# Altium schematic sheet MCUCustom.SchDoc
size OrCAD C; SheetNumber: 2; SheetTotal: 6
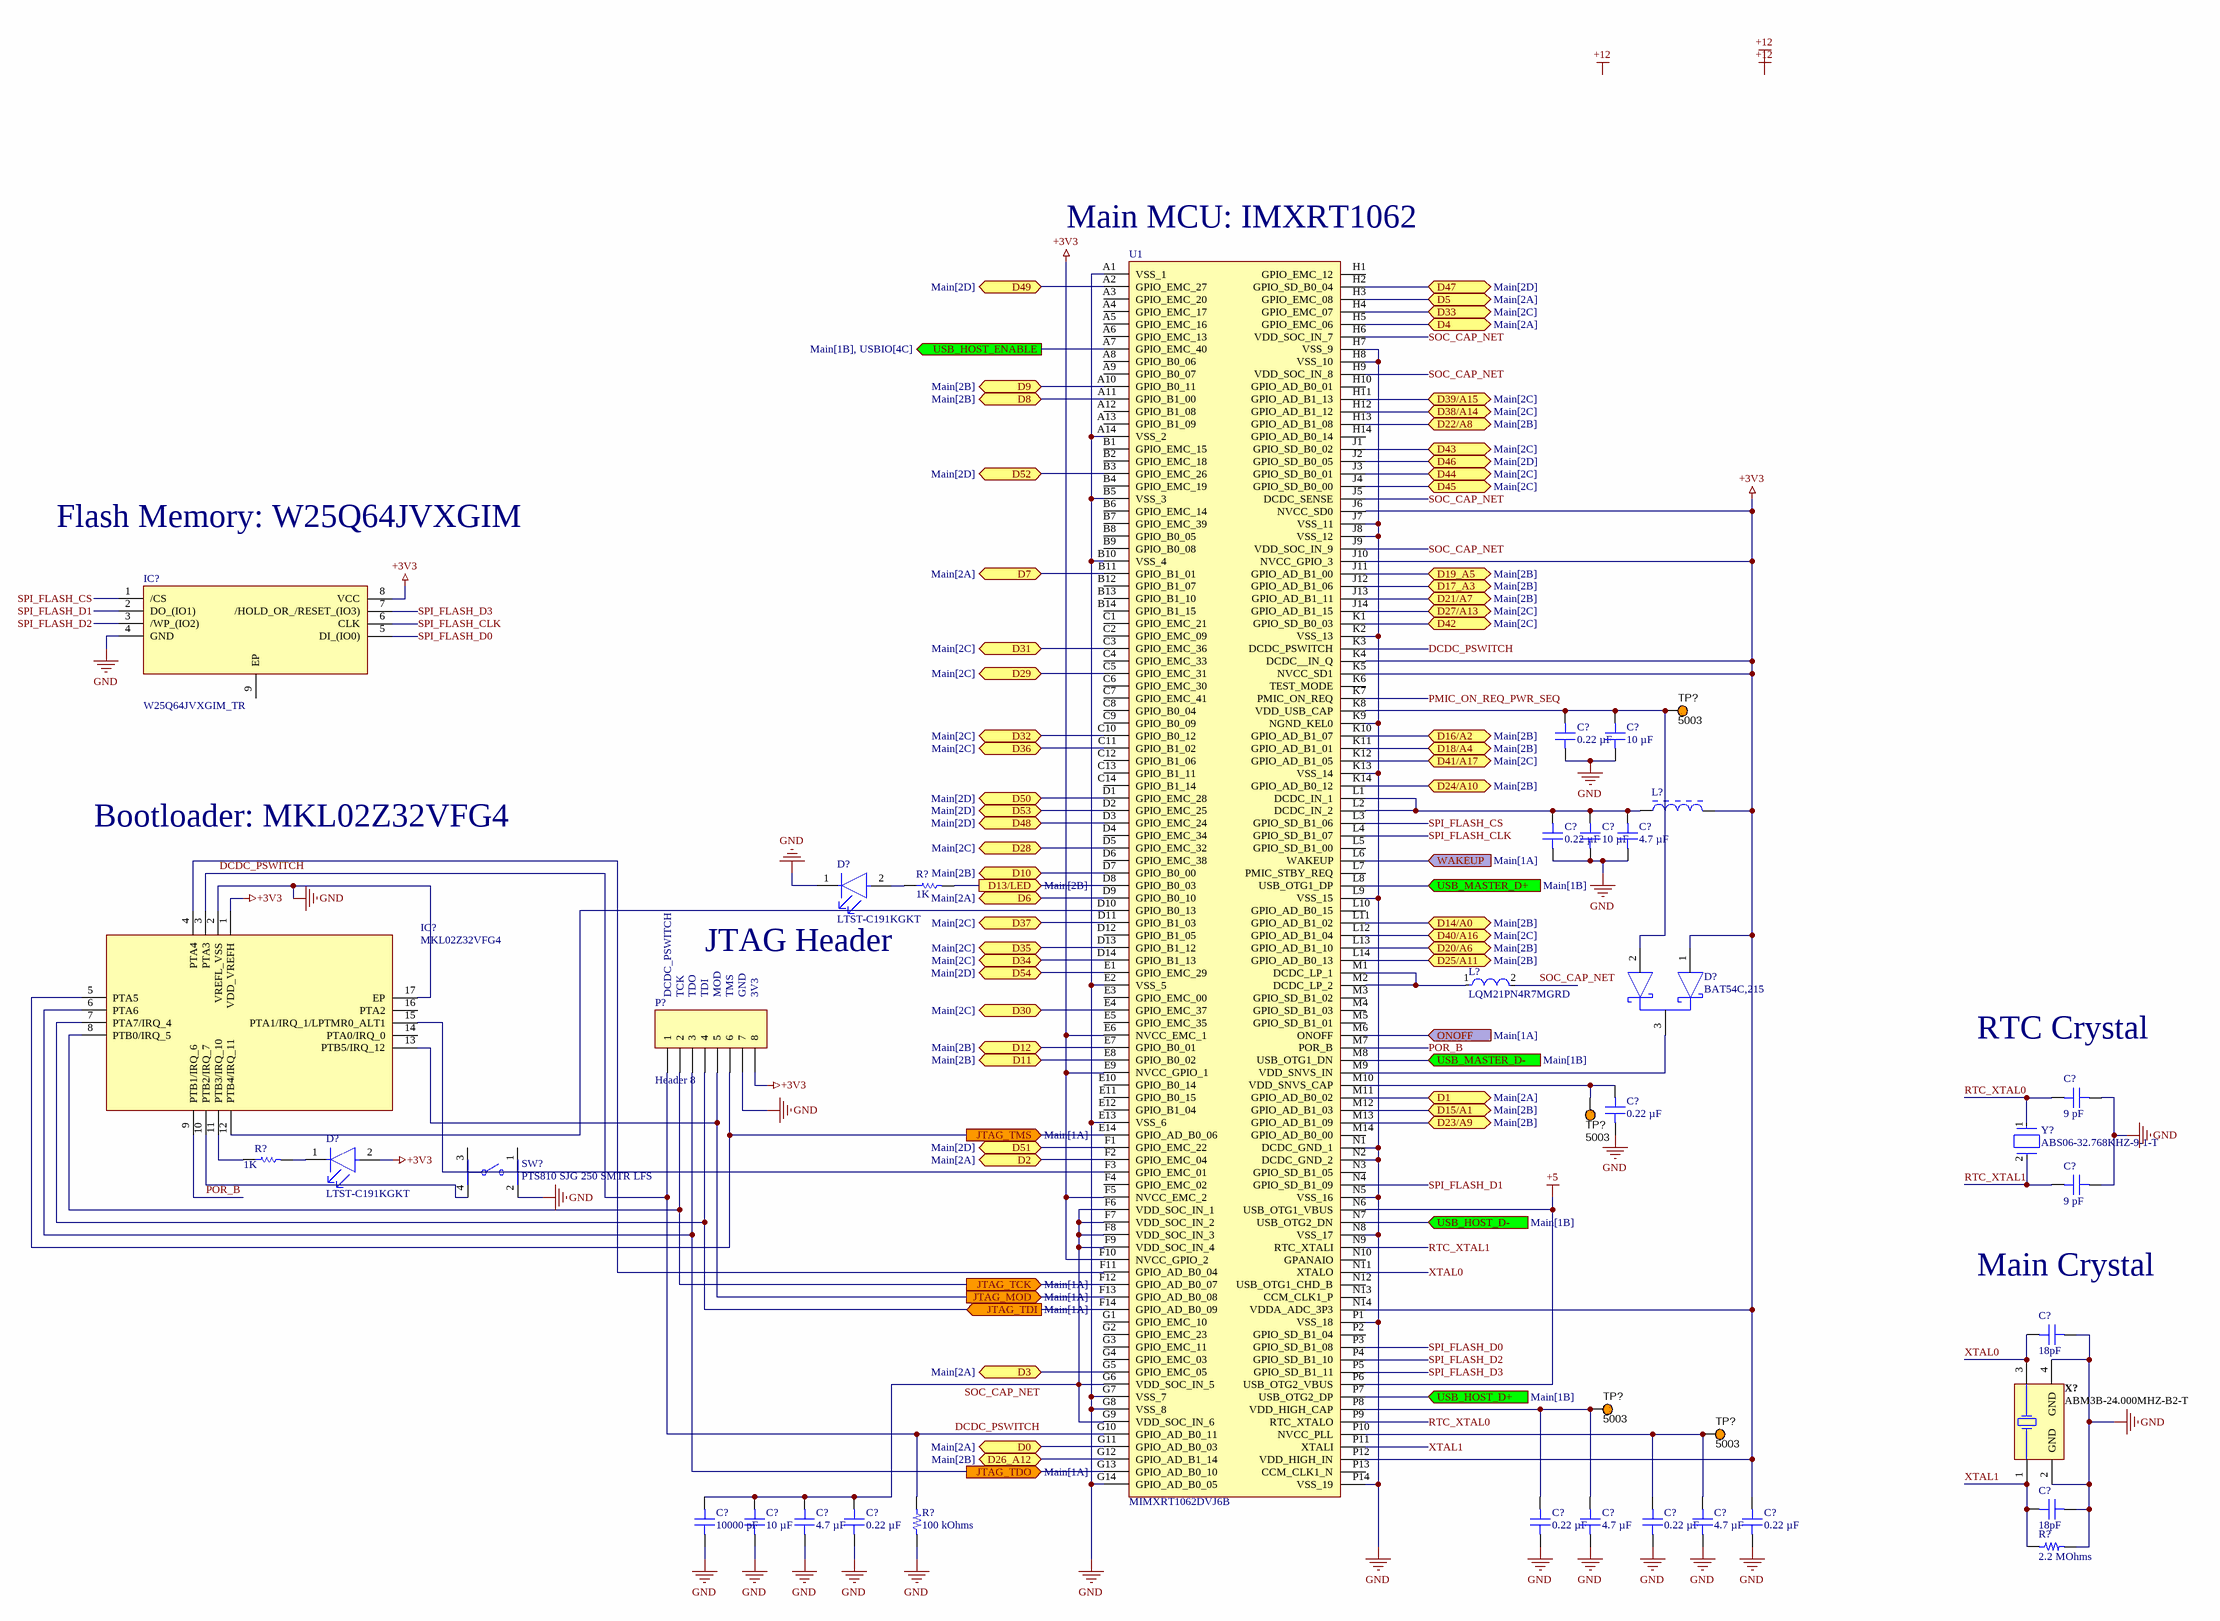
[diagram p0: MCUCustom.SchDoc]

## Parts
(Parts that share a designator on the sheet are numbered #1, #2 ... from top to bottom, then left to right.)
C?#1  0.22 µF  [CAP 0603_1608]
C?#2  10 µF  [CAP 0603_1608]
C?#3  0.22 µF  [CAP 0603_1608]
C?#4  10 µF  [CAP 0603_1608]
C?#5  4.7 µF  [CAP 0603_1608]
C?#6  9 pF  [CAP 0603_1608]
C?#7  0.22 µF  [CAP 0603_1608]
C?#8  9 pF  [CAP 0603_1608]
C?#9  18pF  [CAP 0603_1608]
C?#10  18pF  [CAP 0603_1608]
C?#11  10000 pF  [CAP 0603_1608]
C?#12  10 µF  [CAP 0603_1608]
C?#13  4.7 µF  [CAP 0603_1608]
C?#14  0.22 µF  [CAP 0603_1608]
C?#15  0.22 µF  [CAP 0603_1608]
C?#16  4.7 µF  [CAP 0603_1608]
C?#17  0.22 µF  [CAP 0603_1608]
C?#18  4.7 µF  [CAP 0603_1608]
C?#19  0.22 µF  [CAP 0603_1608]
D?#1  LTST-C191KGKT  [FP-LTST-C191KGKT-MFG]
D?#2  BAT54C,215  [FP-SOT23-MFG]
D?#3  LTST-C191KGKT  [FP-LTST-C191KGKT-MFG]
IC?#1  W25Q64JVXGIM_TR  [SON80P400X400X50-9N]
IC?#2  MKL02Z32VFG4  [QFN50P300X300X65-17N-D]
L?#1  BLM18AG121SN1D  [MURA-BLM18-F-H1-CHIP-2_V]  (value not drawn)
L?#2  LQM21PN4R7MGRD  [FP-LQM21PH_G0-IPC_C]
P?  Header 8  [HDR1X8]
R?#1  value 1K  (hidden comment: Resistor)
R?#2  value 1K  (hidden comment: Resistor)
R?#3  100 kOhms  [RES 0603_1608]
R?#4  2.2 MOhms  [RES 0603_1608]
SW?  PTS810 SJG 250 SMTR LFS  [FP-PTS810_SJG_250_SMTR_LF-MFG]
TP?#1  5003  [KSTN-5003]
TP?#2  5003  [KSTN-5003]
TP?#3  5003  [KSTN-5003]
TP?#4  5003  [KSTN-5003]
U1  MIMXRT1062DVJ6B  [BGA196C80P14X14_1200X1200X152]
X?  ABM3B-24.000MHZ-B2-T  [ABRA-ABM3B-4_V]
Y?  ABS06-32.768KHZ-9-1-T  [FP-ABS06-MFG]

## Ports
D0 (bidir, see Main[2A]), D1 (bidir, see Main[2A]), D2 (bidir, see Main[2A]), D3 (bidir, see Main[2A]), D4 (bidir, see Main[2A]), D5 (bidir, see Main[2A]), D6 (bidir, see Main[2A]), D7 (bidir, see Main[2A]), D8 (bidir, see Main[2B]), D9 (bidir, see Main[2B]), D10 (bidir, see Main[2B]), D11 (bidir, see Main[2B]), D12 (bidir, see Main[2B]), D13/LED (out, see Main[2B]), D14/A0 (bidir, see Main[2B]), D15/A1 (bidir, see Main[2B]), D16/A2 (bidir, see Main[2B]), D17_A3 (bidir, see Main[2B]), D18/A4 (bidir, see Main[2B]), D19_A5 (bidir, see Main[2B]), D20/A6 (bidir, see Main[2B]), D21/A7 (bidir, see Main[2B]), D22/A8 (bidir, see Main[2B]), D23/A9 (bidir, see Main[2B]), D24/A10 (bidir, see Main[2B]), D25/A11 (bidir, see Main[2B]), D26_A12 (bidir, see Main[2B]), D27/A13 (bidir, see Main[2C]), D28 (bidir, see Main[2C]), D29 (bidir, see Main[2C]), D30 (bidir, see Main[2C]), D31 (bidir, see Main[2C]), D32 (bidir, see Main[2C]), D33 (bidir, see Main[2C]), D34 (bidir, see Main[2C]), D35 (bidir, see Main[2C]), D36 (bidir, see Main[2C]), D37 (bidir, see Main[2C]), D38/A14 (bidir, see Main[2C]), D39/A15 (bidir, see Main[2C]), D40/A16 (bidir, see Main[2C]), D41/A17 (bidir, see Main[2C]), D42 (bidir, see Main[2C]), D43 (bidir, see Main[2C]), D44 (bidir, see Main[2C]), D45 (bidir, see Main[2C]), D46 (bidir, see Main[2D]), D47 (bidir, see Main[2D]), D48 (bidir, see Main[2D]), D49 (bidir, see Main[2D]), D50 (bidir, see Main[2D]), D51 (bidir, see Main[2D]), D52 (bidir, see Main[2D]), D53 (bidir, see Main[2D]), D54 (bidir, see Main[2D]), JTAG_MOD (out, see Main[1A]), JTAG_TCK (out, see Main[1A]), JTAG_TDI (in, see Main[1A]), JTAG_TDO (out, see Main[1A]), JTAG_TMS (out, see Main[1A]), ONOFF (in, see Main[1A]), USB_HOST_D+ (in, see Main[1B]), USB_HOST_D- (in, see Main[1B]), USB_HOST_ENABLE (out, see Main[1B], USBIO[4C]), USB_MASTER_D+ (in, see Main[1B]), USB_MASTER_D- (in, see Main[1B]), WAKEUP (in, see Main[1A])

## Nets
+3V3: C?#19.2 D?#2.1(1_ANODE) D?#3.2(A) IC?#1.8(VCC) IC?#2.1(VDD_VREFH) L?#1.2 P?.8 U1.E6(NVCC_EMC_1) U1.E9(NVCC_GPIO_1) U1.F5(NVCC_EMC_2) U1.F10(NVCC_GPIO_2) U1.J6(NVCC_SD0) U1.J10(NVCC_GPIO_3) U1.K4(DCDC__IN_Q) U1.K5(NVCC_SD1) U1.N14(VDDA_ADC_3P3) U1.P12(VDD_HIGH_IN)
+5: U1.N6(USB_OTG1_VBUS) U1.P6(USB_OTG2_VBUS)
GND: C?#1.1 C?#2.1 C?#3.1 C?#4.1 C?#5.1 C?#6.1 C?#7.1 C?#8.1 C?#9.2 C?#10.2 C?#11.1 C?#12.1 C?#13.1 C?#14.1 C?#15.1 C?#16.1 C?#17.1 C?#18.1 C?#19.1 D?#1.1(C) IC?#1.4(GND) IC?#2.2(VREFL_VSS) IC?#2.17(EP) P?.7 R?#3.1 R?#4.2 SW?.2 U1.A1(VSS_1) U1.A14(VSS_2) U1.B5(VSS_3) U1.B10(VSS_4) U1.E2(VSS_5) U1.E13(VSS_6) U1.G7(VSS_7) U1.G8(VSS_8) U1.G14(GPIO_AD_B0_05) U1.H7(VSS_9) U1.H8(VSS_10) U1.J7(VSS_11) U1.J8(VSS_12) U1.K2(VSS_13) U1.K9(NGND_KEL0) U1.K13(VSS_14) U1.L9(VSS_15) U1.N1(DCDC_GND_1) U1.N2(DCDC_GND_2) U1.N5(VSS_16) U1.N8(VSS_17) U1.P1(VSS_18) U1.P14(VSS_19) X?.2(GND) X?.4(GND)
D0: U1.G11(GPIO_AD_B0_03) ; port D0
D1: U1.M11(GPIO_AD_B0_02) ; port D1
D2: U1.F2(GPIO_EMC_04) ; port D2
D3: U1.G5(GPIO_EMC_05) ; port D3
D4: U1.H5(GPIO_EMC_06) ; port D4
D5: U1.H3(GPIO_EMC_08) ; port D5
D6: U1.D9(GPIO_B0_10) ; port D6
D7: U1.B11(GPIO_B1_01) ; port D7
D8: U1.A11(GPIO_B1_00) ; port D8
D9: U1.A10(GPIO_B0_11) ; port D9
D10: U1.D7(GPIO_B0_00) ; port D10
D11: U1.E8(GPIO_B0_02) ; port D11
D12: U1.E7(GPIO_B0_01) ; port D12
D13/LED: R?#1.2 U1.D8(GPIO_B0_03) ; port D13/LED
D14/A0: U1.L11(GPIO_AD_B1_02) ; port D14/A0
D15/A1: U1.M12(GPIO_AD_B1_03) ; port D15/A1
D16/A2: U1.K10(GPIO_AD_B1_07) ; port D16/A2
D17_A3: U1.J12(GPIO_AD_B1_06) ; port D17_A3
D18/A4: U1.K11(GPIO_AD_B1_01) ; port D18/A4
D19_A5: U1.J11(GPIO_AD_B1_00) ; port D19_A5
D20/A6: U1.L13(GPIO_AD_B1_10) ; port D20/A6
D21/A7: U1.J13(GPIO_AD_B1_11) ; port D21/A7
D22/A8: U1.H13(GPIO_AD_B1_08) ; port D22/A8
D23/A9: U1.M13(GPIO_AD_B1_09) ; port D23/A9
D24/A10: U1.K14(GPIO_AD_B0_12) ; port D24/A10
D25/A11: U1.L14(GPIO_AD_B0_13) ; port D25/A11
D26_A12: U1.G12(GPIO_AD_B1_14) ; port D26_A12
D27/A13: U1.J14(GPIO_AD_B1_15) ; port D27/A13
D28: U1.D5(GPIO_EMC_32) ; port D28
D29: U1.C5(GPIO_EMC_31) ; port D29
D30: U1.E4(GPIO_EMC_37) ; port D30
D31: U1.C3(GPIO_EMC_36) ; port D31
D32: U1.C10(GPIO_B0_12) ; port D32
D33: U1.H4(GPIO_EMC_07) ; port D33
D34: U1.D14(GPIO_B1_13) ; port D34
D35: U1.D13(GPIO_B1_12) ; port D35
D36: U1.C11(GPIO_B1_02) ; port D36
D37: U1.D11(GPIO_B1_03) ; port D37
D38/A14: U1.H12(GPIO_AD_B1_12) ; port D38/A14
D39/A15: U1.H11(GPIO_AD_B1_13) ; port D39/A15
D40/A16: U1.L12(GPIO_AD_B1_04) ; port D40/A16
D41/A17: U1.K12(GPIO_AD_B1_05) ; port D41/A17
D42: U1.K1(GPIO_SD_B0_03) ; port D42
D43: U1.J1(GPIO_SD_B0_02) ; port D43
D44: U1.J3(GPIO_SD_B0_01) ; port D44
D45: U1.J4(GPIO_SD_B0_00) ; port D45
D46: U1.J2(GPIO_SD_B0_05) ; port D46
D47: U1.H2(GPIO_SD_B0_04) ; port D47
D48: U1.D3(GPIO_EMC_24) ; port D48
D49: U1.A2(GPIO_EMC_27) ; port D49
D50: U1.D1(GPIO_EMC_28) ; port D50
D51: U1.F1(GPIO_EMC_22) ; port D51
D52: U1.B3(GPIO_EMC_26) ; port D52
D53: U1.D2(GPIO_EMC_25) ; port D53
D54: U1.E1(GPIO_EMC_29) ; port D54
DCDC_PSWITCH: IC?#2.3(PTA3) P?.1 R?#3.2 U1.G10(GPIO_AD_B0_11) U1.K3(DCDC_PSWITCH)
JTAG_MOD: IC?#2.13(PTB5/IRQ_12) P?.5 U1.F13(GPIO_AD_B0_08) ; port JTAG_MOD
JTAG_TCK: IC?#2.8(PTB0/IRQ_5) P?.2 U1.F12(GPIO_AD_B0_07) ; port JTAG_TCK
JTAG_TDI: IC?#2.7(PTA7/IRQ_4) P?.4 U1.F14(GPIO_AD_B0_09) ; port JTAG_TDI
JTAG_TDO: IC?#2.6(PTA6) P?.3 U1.G13(GPIO_AD_B0_10) ; port JTAG_TDO
JTAG_TMS: IC?#2.5(PTA5) P?.6 U1.E14(GPIO_AD_B0_06) ; port JTAG_TMS
ONOFF: U1.M6(ONOFF) ; port ONOFF
PMIC_ON_REQ_PWR_SEQ: U1.K7(PMIC_ON_REQ)
POR_B: IC?#2.9(PTB1/IRQ_6) U1.M7(POR_B)
RTC_XTAL0: C?#6.2 U1.P9(RTC_XTALO) Y?.1
RTC_XTAL1: C?#8.2 U1.N9(RTC_XTALI) Y?.2
SOC_CAP_NET: C?#11.2 C?#12.2 C?#13.2 C?#14.2 L?#2.2 U1.F6(VDD_SOC_IN_1) U1.F7(VDD_SOC_IN_2) U1.F8(VDD_SOC_IN_3) U1.F9(VDD_SOC_IN_4) U1.G6(VDD_SOC_IN_5) U1.G9(VDD_SOC_IN_6) U1.H6(VDD_SOC_IN_7) U1.H9(VDD_SOC_IN_8) U1.J5(DCDC_SENSE) U1.J9(VDD_SOC_IN_9)
SPI_FLASH_CLK: IC?#1.6(CLK) U1.L4(GPIO_SD_B1_07)
SPI_FLASH_CS: IC?#1.1(/CS) U1.L3(GPIO_SD_B1_06)
SPI_FLASH_D0: IC?#1.5(DI_(IO0)) U1.P3(GPIO_SD_B1_08)
SPI_FLASH_D1: IC?#1.2(DO_(IO1)) U1.N4(GPIO_SD_B1_09)
SPI_FLASH_D2: IC?#1.3(/WP_(IO2)) U1.P4(GPIO_SD_B1_10)
SPI_FLASH_D3: IC?#1.7(/HOLD_OR_/RESET_(IO3)) U1.P5(GPIO_SD_B1_11)
USB_HOST_D+: U1.P7(USB_OTG2_DP) ; port USB_HOST_D+
USB_HOST_D-: U1.N7(USB_OTG2_DN) ; port USB_HOST_D-
USB_HOST_ENABLE: U1.A7(GPIO_EMC_40) ; port USB_HOST_ENABLE
USB_MASTER_D+: U1.L8(USB_OTG1_DP) ; port USB_MASTER_D+
USB_MASTER_D-: U1.M8(USB_OTG1_DN) ; port USB_MASTER_D-
WAKEUP: U1.L6(WAKEUP) ; port WAKEUP
XTAL0: C?#9.1 U1.N11(XTALO) X?.3(X2)
XTAL1: C?#10.1 R?#4.1 U1.P11(XTALI) X?.1(X1)
NetC?#1_2: C?#1.2 C?#2.2 D?#2.2(2_ANODE) TP?#1.1 U1.K8(VDD_USB_CAP)
NetC?#3_2: C?#3.2 C?#4.2 C?#5.2 L?#1.1 U1.L1(DCDC_IN_1) U1.L2(DCDC_IN_2)
NetC?#7_2: C?#7.2 TP?#2.1 U1.M10(VDD_SNVS_CAP)
NetC?#15_2: C?#15.2 C?#16.2 TP?#3.1 U1.P8(VDD_HIGH_CAP)
NetC?#17_2: C?#17.2 C?#18.2 TP?#4.1 U1.P10(NVCC_PLL)
NetD?#1_2: D?#1.2(A) R?#1.1
NetD?#2_3: D?#2.3(COMMON_CATHODE) U1.M9(VDD_SNVS_IN)
NetD?#3_1: D?#3.1(C) R?#2.2
NetIC?#2_4: IC?#2.4(PTA4) U1.F11(GPIO_AD_B0_04)
NetIC?#2_10: IC?#2.10(PTB2/IRQ_7) SW?.4
NetIC?#2_11: IC?#2.11(PTB3/IRQ_10) R?#2.1
NetIC?#2_12: IC?#2.12(PTB4/IRQ_11) U1.D10(GPIO_B0_13)
NetIC?#2_15: IC?#2.15(PTA1/IRQ_1/LPTMR0_ALT1) U1.F3(GPIO_EMC_01)
NetL?#2_1: L?#2.1 U1.M1(DCDC_LP_1) U1.M2(DCDC_LP_2)

Not connected (* = marked no-connect by the designer): IC?#1 9(EP); IC?#2 14(PTA0/IRQ_0) 16(PTA2); SW? 1 3; U1 A3(GPIO_EMC_20) A4(GPIO_EMC_17) A5(GPIO_EMC_16) A6(GPIO_EMC_13) A8(GPIO_B0_06) A9(GPIO_B0_07) A12(GPIO_B1_08) A13(GPIO_B1_09) B1(GPIO_EMC_15) B2(GPIO_EMC_18) B4(GPIO_EMC_19) B6(GPIO_EMC_14) B7(GPIO_EMC_39) B8(GPIO_B0_05) B9(GPIO_B0_08) B12(GPIO_B1_07) B13(GPIO_B1_10) B14(GPIO_B1_15) C1(GPIO_EMC_21) C2(GPIO_EMC_09) C4(GPIO_EMC_33) C6(GPIO_EMC_30) C7(GPIO_EMC_41) C8(GPIO_B0_04) C9(GPIO_B0_09) C12(GPIO_B1_06) C13(GPIO_B1_11) C14(GPIO_B1_14) D4(GPIO_EMC_34) D6(GPIO_EMC_38) D12(GPIO_B1_05) E3(GPIO_EMC_00) E5(GPIO_EMC_35) E10(GPIO_B0_14) E11(GPIO_B0_15) E12(GPIO_B1_04) F4(GPIO_EMC_02) G1(GPIO_EMC_10) G2(GPIO_EMC_23) G3(GPIO_EMC_11) G4(GPIO_EMC_03) H1(GPIO_EMC_12) H10(GPIO_AD_B0_01) H14(GPIO_AD_B0_14) K6(TEST_MODE) L5(GPIO_SD_B1_00) L7(PMIC_STBY_REQ) L10(GPIO_AD_B0_15) M3(GPIO_SD_B1_02) M4(GPIO_SD_B1_03) M5(GPIO_SD_B1_01) M14(GPIO_AD_B0_00) N3(GPIO_SD_B1_05) N10(GPANAIO) N12(USB_OTG1_CHD_B) N13(CCM_CLK1_P) P2(GPIO_SD_B1_04) P13(CCM_CLK1_N)

## Notes on the sheet
- (near U1) Main MCU: IMXRT1062
- Flash Memory: W25Q64JVXGIM
- Bootloader: MKL02Z32VFG4
- JTAG Header
- DCDC_PSWITCH
- TCK
- TDO
- TDI
- MOD
- TMS
- GND
- 3V3
- RTC Crystal
- Main Crystal
- Labels drawn without touching a wire or pin: +12

## Library data of the parts
C?#1 C?#3 C?#7 C?#14 C?#15 C?#17 C?#19 = CC0603KRX7R8BB224: CAP CER 0.22UF 25V X7R 0603; manufacturer: Yageo; Tolerance: ±10%; Part Number: CC0603KRX7R8BB224; Value: 0.22 µF; Applications: General Purpose; Capacitance: 0.22 µF; componentlink1description: Datasheet; componentlink1url: https://www.yageo.com/upload/media/product/productsearch/datasheet/mlcc/UPY-GPHC_X7R_6.3V-to-50V_18.pdf; componentlink2description: DigiKey Link; componentlink2url: https://www.digikey.com/en/products/detail/yageo/CC0603KRX7R8BB224/5195211; Device Package: 0603 (1608 Metric); lastupdated: 2/6/2023 8:08:53 PM; Lifecycle Status: Active; Minimum Order: 1; Mounting Type: Surface Mount, MLCC; Operating Temperature: -55°C ~ 125°C; Package / Case: 0603 (1608 Metric); packaging: TapeAndReel; partid: 2214; Part Status: Active; price: 0.01; series: CC; Size / Dimension: 0.063" L x 0.031" W (1.60mm x 0.80mm); Supplier 1: DigiKey; Supplier Part Number 1: 311-1803-1-ND; Temperature Coefficient: X7R; Thickness (Max): 0.035" (0.90mm); Voltage - Rated: 25V
C?#2 C?#4 C?#12 = GRM188R60G106ME47D: CAP CER 10UF 4V X5R 0603; manufacturer: Murata Electronics; Tolerance: ±20%; Part Number: GRM188R60G106ME47D; Value: 10 µF; Applications: General Purpose; Capacitance: 10 µF; componentlink1description: Datasheet; componentlink1url: https://www.murata.com/~/media/webrenewal/support/library/catalog/products/capacitor/mlcc/c02e.ashx?la=en-us; componentlink2description: DigiKey Link; componentlink2url: https://www.digikey.com/en/products/detail/murata-electronics/GRM188R60G106ME47D/702562; Device Package: 0603 (1608 Metric); lastupdated: 2/6/2023 8:08:52 PM; Lifecycle Status: Active; Minimum Order: 1; Mounting Type: Surface Mount, MLCC; Operating Temperature: -55°C ~ 85°C; Package / Case: 0603 (1608 Metric); packaging: TapeAndReel; partid: 2393; Part Status: Active; price: 0.01; series: GRM; Size / Dimension: 0.063" L x 0.031" W (1.60mm x 0.80mm); Supplier 1: DigiKey; Supplier Part Number 1: 490-3298-1-ND; Temperature Coefficient: X5R; Thickness (Max): 0.035" (0.90mm); Voltage - Rated: 4V
C?#5 C?#13 C?#16 C?#18 = GRM188R61C475KE11D: CAP CER 4.7UF 16V X5R 0603; manufacturer: Murata Electronics; Tolerance: ±10%; Part Number: GRM188R61C475KE11D; Value: 4.7 µF; Applications: General Purpose; Capacitance: 4.7 µF; componentlink1description: Datasheet; componentlink1url: https://search.murata.co.jp/Ceramy/image/img/A01X/G101/ENG/GRM188R61C475KE11-01.pdf; componentlink2description: DigiKey Link; componentlink2url: https://www.digikey.com/en/products/detail/murata-electronics/GRM188R61C475KE11D/4905341; Device Package: 0603 (1608 Metric); lastupdated: 2/6/2023 8:08:52 PM; Lifecycle Status: Active; Minimum Order: 1; Mounting Type: Surface Mount, MLCC; Operating Temperature: -55°C ~ 85°C; Package / Case: 0603 (1608 Metric); packaging: TapeAndReel; partid: 2388; Part Status: Active; price: 0.03; series: GRM; Size / Dimension: 0.063" L x 0.031" W (1.60mm x 0.80mm); Supplier 1: DigiKey; Supplier Part Number 1: 490-10730-1-ND; Temperature Coefficient: X5R; Thickness (Max): 0.037" (0.95mm); Voltage - Rated: 16V
C?#6 C?#8 = CC0603CRNPO9BN9R0: CAP CER 9PF 50V C0G/NPO 0603; manufacturer: Yageo; Temperature Coefficient: C0G, NP0; Tolerance: ±0.25pF; Part Number: CC0603CRNPO9BN9R0; Value: 9 pF; Applications: General Purpose; Capacitance: 9 pF; componentlink1description: Datasheet; componentlink1url: https://www.yageo.com/upload/media/product/productsearch/datasheet/mlcc/UPY-GP_NP0_16V-to-50V_17.pdf; componentlink2description: DigiKey Link; componentlink2url: https://www.digikey.com/en/products/detail/yageo/CC0603CRNPO9BN9R0/5883464; Device Package: 0603 (1608 Metric); lastupdated: 2/6/2023 8:08:52 PM; Lifecycle Status: Active; Minimum Order: 1; Mounting Type: Surface Mount, MLCC; Operating Temperature: -55°C ~ 125°C; Package / Case: 0603 (1608 Metric); packaging: TapeAndReel; partid: 2329; Part Status: Active; price: 0.01; series: CC; Size / Dimension: 0.063" L x 0.031" W (1.60mm x 0.80mm); Supplier 1: DigiKey; Supplier Part Number 1: 311-3866-1-ND; Thickness (Max): 0.035" (0.90mm); Voltage - Rated: 50V
C?#9 C?#10 = 06033A180JAT2A: CAP CER 18PF 25V C0G/NP0 0603; manufacturer: AVX Corporation; Temperature Coefficient: C0G, NP0; Tolerance: ±5%; Part Number: 06033A180JAT2A; Value: 18pF; Applications: General Purpose; Capacitance: 18pF; componentlink1description: Datasheet; componentlink1url: http://datasheets.avx.com/C0GNP0-Dielectric.pdf; componentlink2description: DigiKey Link; componentlink2url: http://digikey.com/product-detail/en/avx-corporation/06033A180JAT2A/478-12677-1-ND/9949213; Device Package: 0603 (1608 Metric); lastupdated: 9/2/2020 1:03:34 AM; Lifecycle Status: Active; Minimum Order: 1; Mounting Type: Surface Mount, MLCC; Operating Temperature: -55°C ~ 125°C; Package / Case: 0603 (1608 Metric); packaging: TapeAndReel; partid: 3088; Part Status: Active; price: 0.04; series: -; Size / Dimension: 0.063" L x 0.032" W (1.60mm x 0.81mm); Supplier 1: DigiKey; Supplier Part Number 1: 478-12677-1-ND; Thickness (Max): 0.035" (0.90mm); Voltage - Rated: 25V
C?#11 = C0603X103K1RAC3316: CAP CER 0603 10NF 100V X7R; manufacturer: KEMET; Tolerance: ±10%; Part Number: C0603X103K1RAC3316; Value: 10000 pF; Applications: Automotive, Boardflex Sensitive; Capacitance: 10000 pF; componentlink1description: Datasheet; componentlink1url: https://api.kemet.com/component-edge/download/datasheet/C0603X103K1RAC3316.pdf; componentlink2description: DigiKey Link; componentlink2url: https://www.digikey.com/en/products/detail/kemet/C0603X103K1RAC3316/10315782; Device Package: 0603 (1608 Metric); Features: Soft Termination; lastupdated: 2/6/2023 8:08:35 PM; Lifecycle Status: Active; Minimum Order: 1; Mounting Type: Surface Mount, MLCC; Operating Temperature: -55°C ~ 125°C; Package / Case: 0603 (1608 Metric); packaging: TapeAndReel; partid: 8591; Part Status: Active; price: 0.07; Ratings: AEC-Q200; series: SMD Auto X7R VW80808; Size / Dimension: 0.063" L x 0.031" W (1.60mm x 0.80mm); Supplier 1: DigiKey; Supplier Part Number 1: 399-C0603X103K1RAC3316CT-ND; Temperature Coefficient: X7R; Thickness (Max): 0.037" (0.95mm); Voltage - Rated: 100V
D?#1 D?#3 = CMP-2000-05198-2: LED GREEN CLEAR SMD; Max Power Dissipation: 75mW; Forward Current: 30mA; Reverse Voltage: 5V; Lens Color: Colorless; Forward Voltage: 2V; Dominant Wavelength: 571nm; Number of LEDs: 1; Viewing Angle: 130°; Lens Style: Rectangular; Test Current: 20mA; Luminous Intensity: 35mcd; Wavelength: 574nm; Width: 0.8mm; Case Code (Imperial): 0603; Number of Pins: 2; Lead Free: Lead Free; Packaging: Tape and Reel; Package Quantity: 1; Min Operating Temperature: -55°C; Case/Package: 0603; Length: 1.6mm; Power Dissipation: 75mW; Depth: 0.8mm; Radiation Hardening: No; Mount: Surface Mount; Max Operating Temperature: 85°C; Color: Green; Power Rating: 75mW; Height: 0.55mm; Illumination Color: Green; Case Code (Metric): 1608; Lens Transparency: Clear; Number of Elements: 1
D?#2 = CMP-14398-000007-1: DIODE ARRAY SCHOTTKY 30V SOT23; Manufacturer: Nexperia; Automotive Grade: Grade 0; Peak Reverse Current: 2uA; Forward Current: 200mA; Max Surge Forward Current: 600mA; Value: 10pF; Max Junction Temp: +150°C; Description: Diode Array 1 Pair Common Cathode Schottky 30V 200mA (DC) Surface Mount TO-236-3, SC-59, SOT-23-3; Lead Free: Yes; Automotive: Yes; Device Class L1: Discrete Semiconductors; Digikey Description: DIODE ARRAY SCHOTTKY 30V SOT23; Reverse Voltage: 30V; ComponentLink2URL: https://assets.nexperia.com/documents/data-sheet/BAT54_SER.pdf; Device Class L2: Diodes; Category: Diode; Octopart: https://octopart.com/bat54c%2C215-nexperia-78738945; Package: SOT23; Mouser Description: Schottky Diodes, Rectifiers - Arrays SOT-23 (TO-236AB) 30V 200mA (DC) Surface Mount; RoHS: TRUE; Manufacturer Part Number: BAT54C,215; Temperature: to +150°C; Ambient Temperature Range Low: -55°C; Height: 1.1mm; Device Class L3: Schottky Diodes; Temperature Range High: +150°C; Footprint Url: https://assets.nexperia.com/documents/outline-drawing/SOT23.pdf; Capacitance: 10pF; Ambient Temperature Range High: +150°C; Ipc Land Pattern Name: SOT95P230X100-3; ComponentLink2Description: Datasheet
IC?#1 = W25Q64JVXGIM_TR: Integrated Circuit; Manufacturer_Name: Winbond; Manufacturer_Part_Number: W25Q64JVXGIM TR; Datasheet Link: https://www.winbond.com/resource-files/w25q64jv_dtr%20revj%2003272018%20plus.pdf; Height: 0.5mm; Mouser Part Number: 454-W25Q64JVXGIMTR; Mouser Price/Stock: https://www.mouser.co.uk/ProductDetail/Winbond/W25Q64JVXGIM-TR?qs=qSfuJ%252Bfl%2Fd5DYf7S8uijYQ%3D%3D; Arrow Part Number: W25Q64JVXGIM TR; Arrow Price/Stock: https://www.arrow.com/en/products/w25q64jvxgim-tr/winbond-electronics
IC?#2 = MKL02Z32VFG4: Integrated Circuit; Manufacturer_Name: NXP; Datasheet Link: http://www.nxp.com/docs/en/data-sheet/KL02P32M48SF0.pdf; Height: 0.65mm; Manufacturer_Part_Number: MKL02Z32VFG4; Mouser Part Number: 841-MKL02Z32VFG4; Mouser Price/Stock: https://www.mouser.co.uk/ProductDetail/NXP-Semiconductors/MKL02Z32VFG4?qs=RECgZY%252BK1xLpPFD7GzHxWg%3D%3D; Arrow Part Number: MKL02Z32VFG4; Arrow Price/Stock: https://www.arrow.com/en/products/mkl02z32vfg4/nxp-semiconductors?region=nac
L?#1 = CMP-006-00004-3: Chip Ferrite Bead for General Use, 120 Ohm, 500 mA, -55 to 125 degC, 0603 (1608 Metric), RoHS, Tape and Reel; Manufacturer: Murata; Max Current Rating: 500mA; Tolerance: 25%; Impedance: 120Ohm; Resistance: 200mohm; Min Operating Temperature: -55°C; Package Reference: BLM18_H950-2; Max Operating Temperature: 125°C; Current Rating: 500mA; Core Material: Ferrite; Datasheet Version: Jun-12; Packaging: TapeandReel; Datasheet URL: https://statics3.seeedstudio.com/images/opl/datasheet/303010016.pdf; Package Quantity: 4000; Case/Package: 0603; RoHS Compliant: True
L?#2 = CMP-06042-017025-1: Multilayer Type Inductor for Power Lines, 0805 (2012), 4.7μH, 20%, 0.288Ω, 0.8A; Core Material: Ferrite; Self Resonant Frequency: 30MHz; DC Resistance (DCR): 288mR; Test Frequency: 1MHz; Shielding: Shielded; Current Rating: 800mA; Inductance: 4.7uH; Mount: Surface Mount; Package Quantity: 4000; Case/Package: 0805; Length: 0.079inch; Packaging: Cut Tape; Height - Seated (Max): 0.039inch; Case Code (Metric): 2012; Case Code (Imperial): 0805; Width: 0.049inch; Max Operating Temperature: 125°C; RoHS Compliant: Yes; Tolerance: 20%; Min Operating Temperature: -55°C
P? = Header 8: Header, 8-Pin; LatestRevisionDate: 17-Jul-2002; LatestRevisionNote: Re-released for DXP Platform.; Publisher: Altium Limited
R?#1 R?#2 = Resistor: TC1: 0; SimulationGenericComponent: True; TC2: 0
R?#3 = AT0603DRD07100KL: RES SMD 100K OHM 0.5% 1/10W 0603; Manufacturer: Yageo; Power (Watts): 0.1W, 1/10W; Temperature Coefficient: ±25ppm/°C; Part Number: AT0603DRD07100KL; Value: 100 kOhms; ComponentLink1Description: Datasheet; ComponentLink1URL: http://www.yageo.com/documents/recent/PYu-AT_51_RoHS_L_5.pdf; ComponentLink2Description: DigiKey Link; ComponentLink2URL: https://www.digikey.com/en/products/detail/yageo/AT0603DRD07100KL/5908403; Composition: Thin Film; Device Package: 0603 (1608 Metric); Features: Anti-Sulfur, Automotive AEC-Q200, Moisture Resistant; Height - Seated (Max): 0.022" (0.55mm); LastUpdated: 2/5/2023 8:28:10 PM; Lifecycle Status: Active; Minimum Order: 1; Number of Terminations: 2; Operating Temperature: -55°C ~ 155°C; Package / Case: 0603 (1608 Metric); Packaging: TapeAndReel; PartId: 4903; Part Status: Active; Price: 0.02; Ratings: AEC-Q200; Resistance: 100 kOhms; Series: AT; Size / Dimension: 0.063" L x 0.031" W (1.60mm x 0.80mm); Supplier 1: DigiKey; Supplier Part Number 1: 311-2103-1-ND; Supplier Device Package: 0603; Tolerance: ±0.5%
R?#4 = RCS06032M20JNEA: RES SMD 2.2M OHM 5% 1/4W 0603; Manufacturer: Vishay Dale; Power (Watts): 0.25W, 1/4W; Temperature Coefficient: ±200ppm/°C; Part Number: RCS06032M20JNEA; Value: 2.2 MOhms; ComponentLink1Description: Datasheet; ComponentLink1URL: http://www.vishay.com/docs/20065/rcse3.pdf; ComponentLink2Description: DigiKey Link; ComponentLink2URL: https://www.digikey.com/en/products/detail/vishay-dale/RCS06032M20JNEA/5866970; Composition: Thick Film; Device Package: 0603 (1608 Metric); Features: Automotive AEC-Q200, Pulse Withstanding; Height - Seated (Max): 0.020" (0.50mm); LastUpdated: 2/5/2023 8:28:09 PM; Lifecycle Status: Active; Minimum Order: 1; Number of Terminations: 2; Operating Temperature: -55°C ~ 155°C; Package / Case: 0603 (1608 Metric); Packaging: TapeAndReel; PartId: 5440; Part Status: Active; Price: 0.02; Ratings: AEC-Q200; Resistance: 2.2 MOhms; Series: RCS e3; Size / Dimension: 0.061" L x 0.033" W (1.55mm x 0.85mm); Supplier 1: DigiKey; Supplier Part Number 1: 541-2824-1-ND; Supplier Device Package: 0603; Tolerance: ±5%
SW? = CMP-10040-000011-1: SWITCH TACTILE SPST-NO 0.05A 16V; Manufacturer: C&K Components; Electromechanical Life: 100000Cycles; Contact Resistance: 500mΩ; Operating Force: 400gf; Current Rating: 50mA; Voltage Rating Dc: 16V; Device Class L2: Switches; Device Class L1: Electromechanical; ComponentLink2URL: https://www.ckswitches.com/media/1476/pts810.pdf; Digikey Description: SWITCH TACTILE SPST-NO 0.05A 16V; RoHS: TRUE; Temperature Range Low: -40°C; Temperature Range High: +85°C; Automotive: No; Category: Switch; ComponentLink2Description: Datasheet; Device Class L3: Tactile Switches; Mouser Description: Switch Tactile N.O. SPST Button J-Bend 0.05A 16VDC 100000Cycles 3.92N SMD T/R; Throw Configuration: SPST-NO; Package: PTS810 SJG 250 SMTR LFS; Height: 2.7mm; Octopart: https://octopart.com/pts810sjg250smtrlfs-c%26k+components-29380277; Manufacturer Part Number: PTS810 SJG 250 SMTR LFS; Temperature: -40°C to +85°C; Lead Free: Yes
TP?#1-TP?#4 = CMP-002-00037-2: Test Point, Orange, Height 4.6 mm, Tail Length 3 mm, 1-Pin THD, RoHS; Manufacturer: Keystone; Colour: Orange; Packaging: Bulk; Package Description: 1-Pin Through Hole Device, Dia 2.54 mm; Pins: 1; Package Reference: 5003; Datasheet Version: Jun-15; Case/Package: 5003; Mounting Technology: TH; Connector Type: TestPoint; Diameter: 2.54mm; Contact Material: Bronze; Datasheet URL: http://keyelco.com/userAssets/file/M65p56.pdf; Manufacturer URL: http://www.keyelco.com/; Package Quantity: 10; Contact Plating: Tin; RoHS Compliant: True
U1 = MIMXRT1062DVJ6B: Integrated Circuit; Manufacturer_Name: NXP; Datasheet Link: https://www.nxp.com/docs/en/nxp/data-sheets/IMXRT1060CEC.pdf; Height: 1.52mm; Manufacturer_Part_Number: MIMXRT1062DVJ6B; Mouser Part Number: 771-MIMXRT1062DVJ6B; Mouser Price/Stock: https://www.mouser.co.uk/ProductDetail/NXP-Semiconductors/MIMXRT1062DVJ6B?qs=BJlw7L4Cy7%252B08A9rbTO5WQ%3D%3D; Arrow Part Number: MIMXRT1062DVJ6B; Arrow Price/Stock: https://www.arrow.com/en/products/mimxrt1062dvj6b/nxp-semiconductors?region=nac
X? = CMP-003-00019-2: Ceramic SMD Crystal, 24 MHz, +/- 20 ppm, 18 pF, -20 to 70 degC, 4-Pin SMD, RoHS, Tape and Reel; Manufacturer: Abracon; Load Capacitance: 18pF; Frequency Tolerance: 20ppm; ESR: 50; Resistance: 50Ohm; Frequency: 24MHz; Package Quantity: 1000; Packaging: TapeandReel; RoHS Compliant: True; Package Description: 4-Pin Surface Mount Device, Body 5 x 3.2 mm; Mounting Technology: SM; Pins: 4; Datasheet URL: http://www.abracon.com/Resonators/abm3b.pdf; Tolerance: 20ppm; Manufacturer URL: http://www.abracon.com/; Max Operating Temperature: 70°C; Datasheet Version: Aug-15; Min Operating Temperature: -20°C; Package Reference: ABM3B; Case/Package: CSMD
Y? = CMP-27762-003430-2: Crystal 32.768kHz ±10ppm (Tol) 9pF FUND 90kΩ 2-Pin Mini-CSMD T/R; Series Resistance: 90kR; Series: ABS06; Case/Package: CSMD; Package Quantity: 3000; Load Capacitance: 9pF; Number of Pins: 2; Tolerance: 10ppm; RoHS Compliant: Yes; Depth: 1.2mm; Termination: SMD/SMT; Min Operating Temperature: -40°C; Length: 2mm; Packaging: Tape and Reel; Max Operating Temperature: 85°C; Frequency Tolerance: 10ppm; Width: 1.2mm; ESR (Equivalent Series Resistance): 90kR; Radiation Hardening: No; Frequency: 32.768kHz; REACH SVHC: No SVHC; Mount: Surface Mount; Height: 0.6mm